# Altium schematic sheet DDR3 Termination.SchDoc
size A4; SheetNumber: 11; SheetTotal: 12
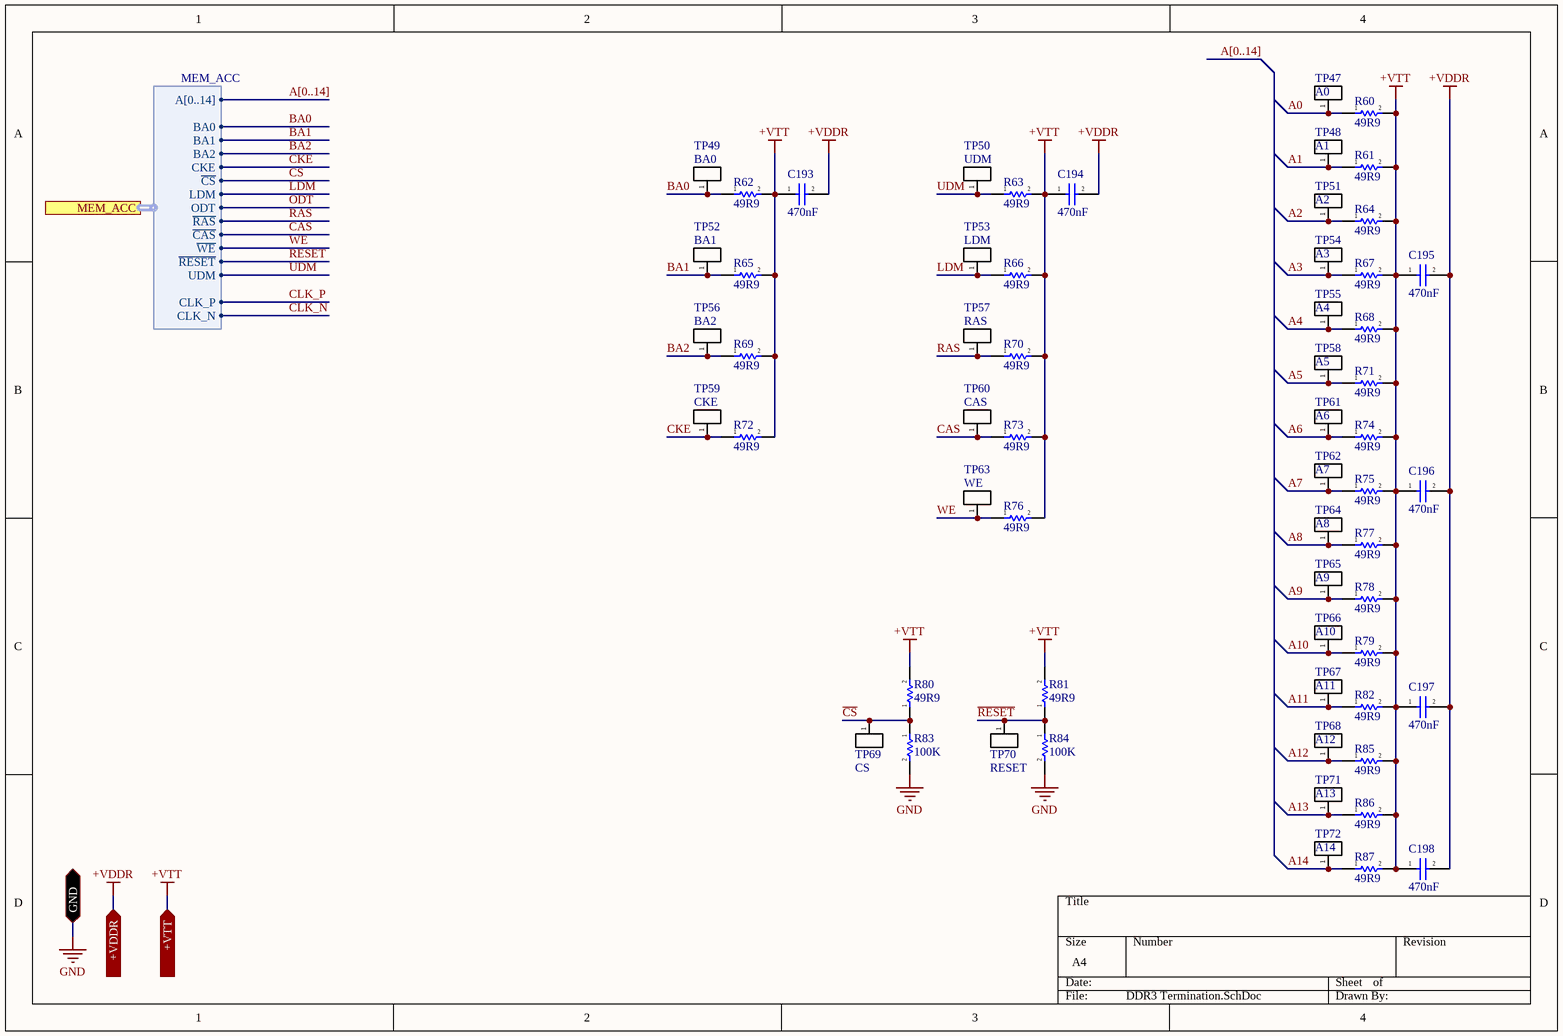
[diagram p0: DDR3 Termination.SchDoc]

## Parts
C193  470nF  [CAP_0402]
C194  470nF  [CAP_0402]
C195  470nF  [CAP_0402]
C196  470nF  [CAP_0402]
C197  470nF  [CAP_0402]
C198  470nF  [CAP_0402]
R60  49R9  [RES_0402]
R61  49R9  [RES_0402]
R62  49R9  [RES_0402]
R63  49R9  [RES_0402]
R64  49R9  [RES_0402]
R65  49R9  [RES_0402]
R66  49R9  [RES_0402]
R67  49R9  [RES_0402]
R68  49R9  [RES_0402]
R69  49R9  [RES_0402]
R70  49R9  [RES_0402]
R71  49R9  [RES_0402]
R72  49R9  [RES_0402]
R73  49R9  [RES_0402]
R74  49R9  [RES_0402]
R75  49R9  [RES_0402]
R76  49R9  [RES_0402]
R77  49R9  [RES_0402]
R78  49R9  [RES_0402]
R79  49R9  [RES_0402]
R80  49R9  [RES_0402]
R81  49R9  [RES_0402]
R82  49R9  [RES_0402]
R83  100K  [RES_0603]
R84  100K  [RES_0603]
R85  49R9  [RES_0402]
R86  49R9  [RES_0402]
R87  49R9  [RES_0402]
TP47  A0  [TP_PAD_TINY]  (no BOM)
TP48  A1  [TP_PAD_TINY]  (no BOM)
TP49  BA0  [TP_PAD_TINY]  (no BOM)
TP50  UDM  [TP_PAD_TINY]  (no BOM)
TP51  A2  [TP_PAD_TINY]  (no BOM)
TP52  BA1  [TP_PAD_TINY]  (no BOM)
TP53  LDM  [TP_PAD_TINY]  (no BOM)
TP54  A3  [TP_PAD_TINY]  (no BOM)
TP55  A4  [TP_PAD_TINY]  (no BOM)
TP56  BA2  [TP_PAD_TINY]  (no BOM)
TP57  RAS  [TP_PAD_TINY]  (no BOM)
TP58  A5  [TP_PAD_TINY]  (no BOM)
TP59  CKE  [TP_PAD_TINY]  (no BOM)
TP60  CAS  [TP_PAD_TINY]  (no BOM)
TP61  A6  [TP_PAD_TINY]  (no BOM)
TP62  A7  [TP_PAD_TINY]  (no BOM)
TP63  WE  [TP_PAD_TINY]  (no BOM)
TP64  A8  [TP_PAD_TINY]  (no BOM)
TP65  A9  [TP_PAD_TINY]  (no BOM)
TP66  A10  [TP_PAD_TINY]  (no BOM)
TP67  A11  [TP_PAD_TINY]  (no BOM)
TP68  A12  [TP_PAD_TINY]  (no BOM)
TP69  CS  [TP_PAD_TINY]  (no BOM)
TP70  RESET  [TP_PAD_TINY]  (no BOM)
TP71  A13  [TP_PAD_TINY]  (no BOM)
TP72  A14  [TP_PAD_TINY]  (no BOM)

## Ports
+VDDR (in), +VTT (in), GND (bidir), MEM_ACC (harness MEM_ACC)

## Harnesses
MEM_ACC: A[0..14], BA0, BA1, BA2, CKE, ~{CS}, LDM, ODT, ~{RAS}, ~{CAS}, ~{WE}, ~{RESET}, UDM, CLK_N, CLK_P

## Nets
+VDDR: C193.2 C194.2 C195.2 C196.2 C197.2 C198.2 ; port +VDDR
+VTT: C193.1 C194.1 C195.1 C196.1 C197.1 C198.1 R60.2 R61.2 R62.2 R63.2 R64.2 R65.2 R66.2 R67.2 R68.2 R69.2 R70.2 R71.2 R72.2 R73.2 R74.2 R75.2 R76.2 R77.2 R78.2 R79.2 R80.2 R81.2 R82.2 R85.2 R86.2 R87.2 ; port +VTT
GND: R83.2 R84.2 ; port GND
~{CAS}: port MEM_ACC.~{CAS}
~{CS}: R80.1 R83.1 TP69.1(A) ; port MEM_ACC.~{CS}
~{RAS}: port MEM_ACC.~{RAS}
~{RESET}: R81.1 R84.1 TP70.1(A) ; port MEM_ACC.~{RESET}
~{WE}: port MEM_ACC.~{WE}
A0: R60.1 TP47.1(A)
A1: R61.1 TP48.1(A)
A2: R64.1 TP51.1(A)
A3: R67.1 TP54.1(A)
A4: R68.1 TP55.1(A)
A5: R71.1 TP58.1(A)
A6: R74.1 TP61.1(A)
A7: R75.1 TP62.1(A)
A8: R77.1 TP64.1(A)
A9: R78.1 TP65.1(A)
A10: R79.1 TP66.1(A)
A11: R82.1 TP67.1(A)
A12: R85.1 TP68.1(A)
A13: R86.1 TP71.1(A)
A14: R87.1 TP72.1(A)
BA0: R62.1 TP49.1(A) ; port MEM_ACC.BA0
BA1: R65.1 TP52.1(A) ; port MEM_ACC.BA1
BA2: R69.1 TP56.1(A) ; port MEM_ACC.BA2
CAS: R73.1 TP60.1(A)
CKE: R72.1 TP59.1(A) ; port MEM_ACC.CKE
CLK_N: port MEM_ACC.CLK_N
CLK_P: port MEM_ACC.CLK_P
LDM: R66.1 TP53.1(A) ; port MEM_ACC.LDM
ODT: port MEM_ACC.ODT
RAS: R70.1 TP57.1(A)
UDM: R63.1 TP50.1(A) ; port MEM_ACC.UDM
WE: R76.1 TP63.1(A)

## Buses and harness runs
bus A[0..14]

## Library data of the parts
C193-C198 = CAP_CER: Generic SMT Ceramic Capacitor; Voltage - Rated: 25V; Operating Temperature: *; Tolerance: *; Mfr: *; ComponentLink1Description: Digikey; ComponentLink1URL: [Digikey Link]; Digikey Part No: *; ComponentLink2Description: Datasheet; ComponentLink2URL: [Datasheet Link]; Footprint: 0402
R60-R82 R85-R87 = RESISTOR: Power: 1/8W; Tolerance: 0.5%; Automotive: *; Operating Temperature: *; Package / Case: 0402; # Digikey: *; ComponentLink1Description: Digikey; ComponentLink1URL: *; # Manufacturer: *
R83 R84 = RESISTOR: Power: 1/16W; Tolerance: 10%; Automotive: *; Operating Temperature: *; # Digikey: *; ComponentLink1Description: Digikey; ComponentLink1URL: *; # Manufacturer: *; Package / Case: 0603
TP47-TP72 = TESTPOINT: Test Point